# EAGLE schematic XBee (EAGLE 6.1)
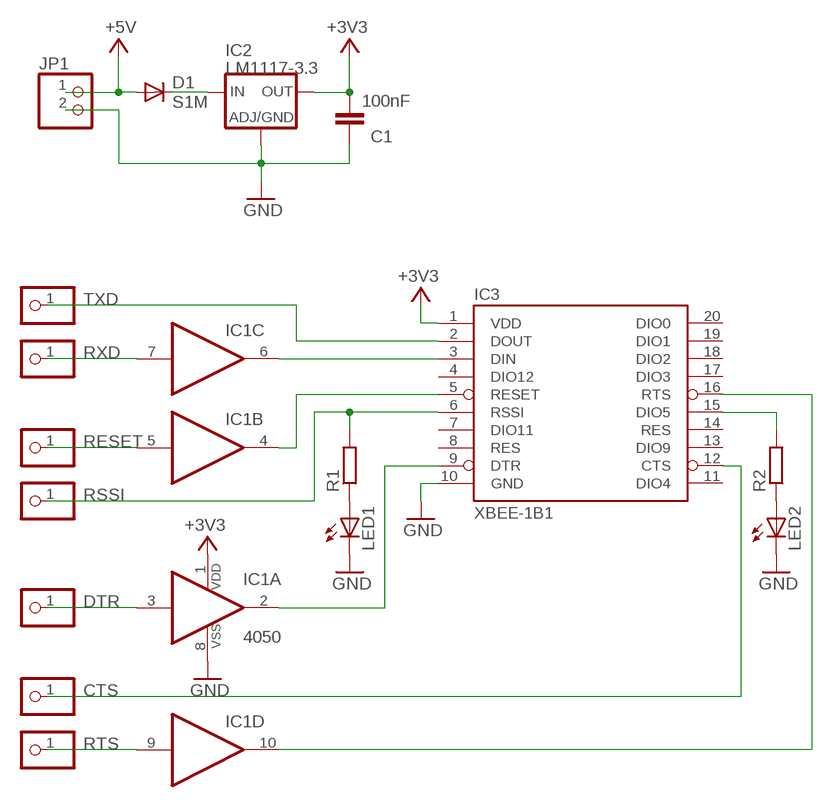
[diagram p0: schematic, sheet 1]

## Parts
C1  100nF  C-EUC0805K  [C0805K]
D1  S1M  [DO-214AC]
IC1  4050  4050D  [SO16]
IC2  LM1117-3.3  LM1117S  [SOT223]
IC3  XBEE-1B1  [XBEE-1]
JP1  PINHD-1X2  [1X02]
JP2  TXD  PINHD-1X1  [1X01]
JP3  RXD  PINHD-1X1  [1X01]
JP4  RST  PINHD-1X1  [1X01]
JP5  RSSI  PINHD-1X1  [1X01]
JP6  DTR  PINHD-1X1  [1X01]
JP7  CTS  PINHD-1X1  [1X01]
JP8  RTS  PINHD-1X1  [1X01]
LED1  LED3MM  [LED3MM]
LED2  LED3MM  [LED3MM]
R1  R-EU_R0805  [R0805]
R2  R-EU_R0805  [R0805]

## Nets
+3V3: C1.2 IC1.1(P:VDD) IC2.2(OUT) IC2.4(OUT) IC3.1(VDD)
+5V: D1.A JP1.1
CTS: IC3.12(CTS) JP7.1
DTR: IC1.3(A:I) JP6.1
GND: C1.1 IC1.8(P:VSS) IC2.1(ADJ) IC3.10(GND) JP1.2 LED1.K(C) LED2.K(C)
N$1: D1.C IC2.3(IN)
N$3: IC1.6(C:O) IC3.3(DIN)
N$4: IC1.4(B:O) IC3.5(RESET)
N$6: LED1.A R1.1
N$7: IC1.2(A:O) IC3.9(DTR)
N$8: IC1.10(D:O) IC3.16(RTS)
N$9: LED2.A R2.1
N$10: IC3.15(DIO5) R2.2
RESET: IC1.5(B:I) JP4.1
RSSI: IC3.6(RSSI) JP5.1 R1.2
RTS: IC1.9(D:I) JP8.1
RXD: IC1.7(C:I) JP3.1
TXD: IC3.2(DOUT) JP2.1
Unconnected: IC1.11(E:I) IC1.12(E:O) IC1.14(F:I) IC1.15(F:O) IC3.4(DIO12) IC3.7(DIO11) IC3.8(RES) IC3.11(DIO4) IC3.13(DIO9) IC3.14(RES) IC3.17(DIO3) IC3.18(DIO2) IC3.19(DIO1) IC3.20(DIO0)

## Library data of the parts
C1 = mark_1:C-EU: CAPACITOR, European symbol
D1 = mark_1:S1M
IC1 = mark_1:4050: Hex non-inverting BUFFER
IC2 = mark_1:LM1117: Low drop fixed and adjustable positive voltage regulators 1 A Source: http://www.st.com/stonline/products/literature/ds/7194/ld1117axx.pdf
IC3 = mark_1:XBEE-1
JP1 = mark_1:PINHD-1X2: PIN HEADER
JP2-JP8 = mark_1:PINHD-1X1: PIN HEADER
LED1 LED2 = mark_1:LED
R1 R2 = mark_1:R-EU_: RESISTOR, European symbol